# EasyEDA schematic SCH_Acid Charger - V1.json
TITLE: Sheet_1; REV: 1.0; Date: 2022-08-11; Sheet: 1/1; Drawn By: Giuseppe Mento; Company: Your Company
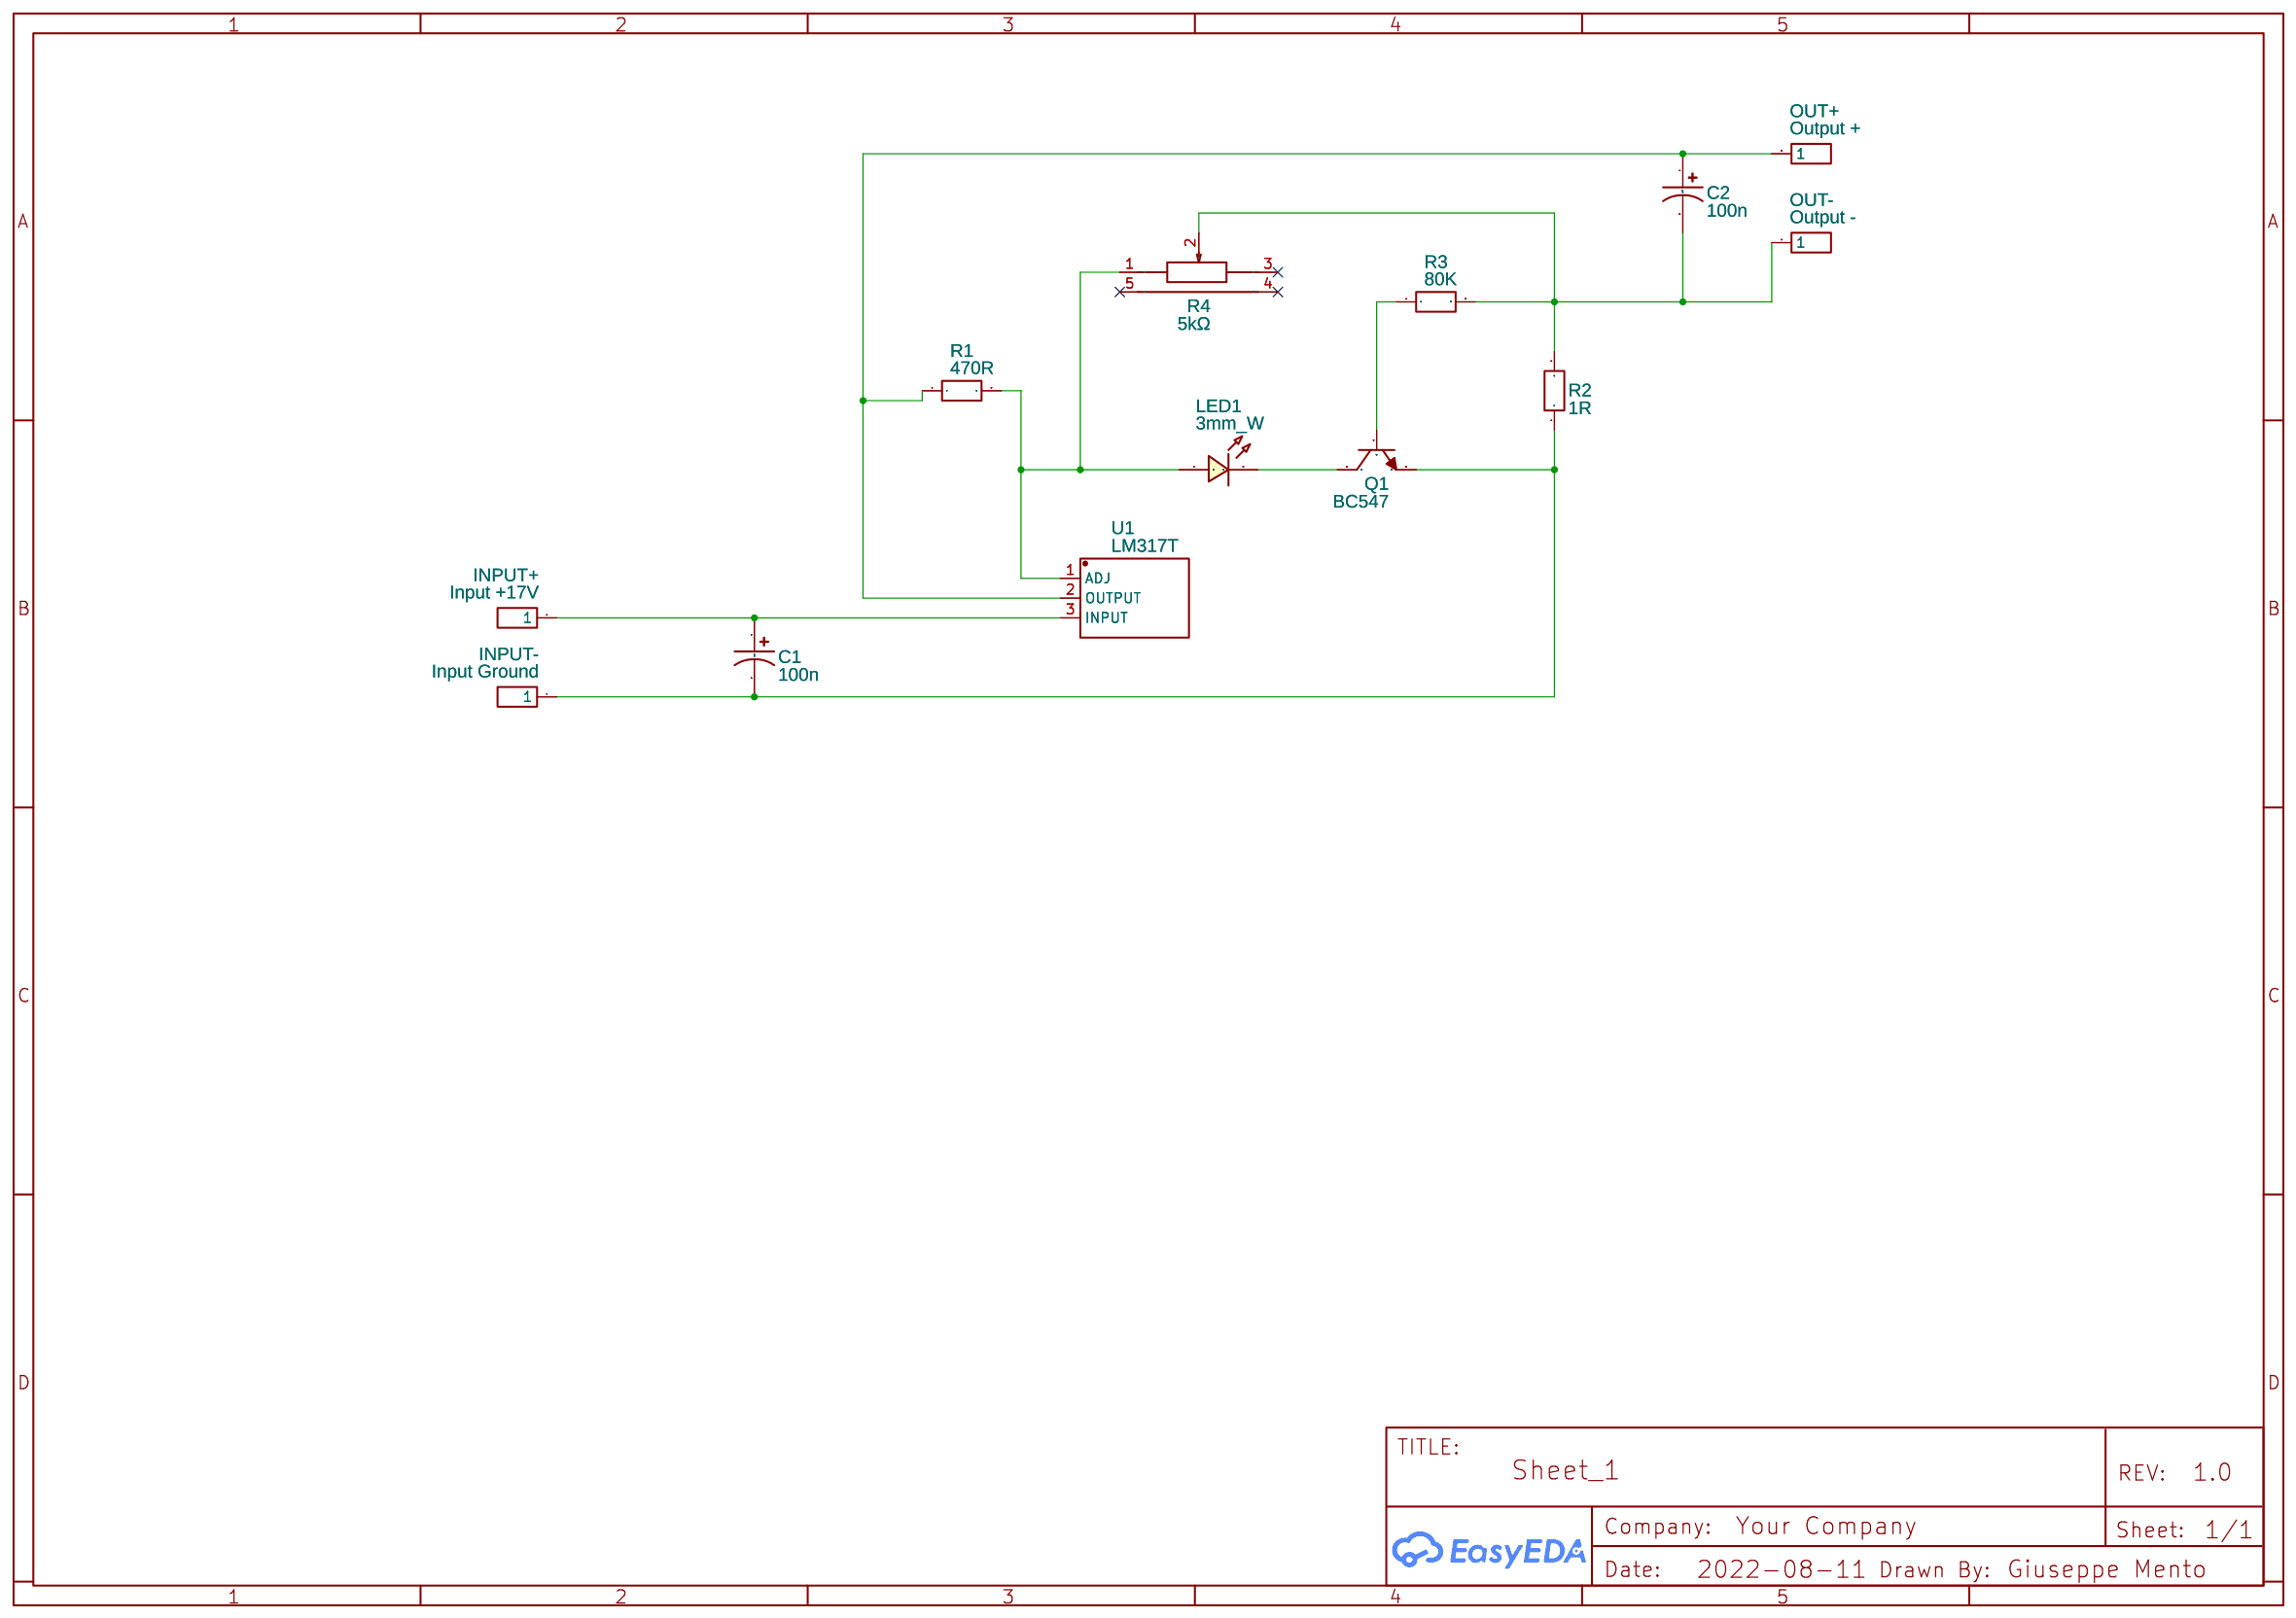
[diagram p0: schematic sheet]

## Parts
C1  100n  [CAP-D3.0×F1.5]
C2  100n  [CAP-D3.0×F1.5]
INPUT+  Input +17V  [HDR-M-2.54_1X1]
INPUT-  Input Ground  [HDR-M-2.54_1X1]
LED1  3mm_W  [LED-TH_BD3.0_BLUE]
OUT+  Output +  [HDR-M-2.54_1X1]
OUT-  Output -  [HDR-M-2.54_1X1]
Q1  BC547  [TO-92-3_L4.8-W3.7-P1.27-L]
R1  470R  [R_AXIAL-0.4]
R2  1R  [R_AXIAL-0.6]
R3  80K  [R_AXIAL-0.4]
R4  5kΩ  [RES-TH_RK09K1130A70]
U1  LM317T  [TO-220AB-3_L10.4-W4.6-P2.54-T]

## Library data of the parts
C1 C2 = CE_TH_D3.0×F1.5_US: Contributor: LCEDA_Lib
INPUT+ INPUT- OUT+ OUT- = HDR-M-2.54_1x1: Supplier Part: C81276; Supplier: LCSC; Contributor: LCEDA_Lib
LED1 = LED-TH-3mm_B: Manufacturer: EVERLIGHT(台湾亿光); Manufacturer Part: 204-10SUBC/S400-A4; Supplier Part: C86881; Supplier: LCSC; Contributor: LCEDA_Lib
Q1 = BC547: Supplier: LCSC; Supplier Part: C2910381; Manufacturer: CJ（江苏长电/长晶）; link: https://atta.szlcsc.com/upload/public/pdf/source/20220322/35437BB3E522E0C3E451097265A180DC.pdf; Contributor: LCSC
R1 R3 = R_AXIAL-0.6_EU: Contributor: LCEDA_Lib
R2 = R_AXIAL-0.6_EU: Contributor: LCEDA_Lib; Package Display: No
R4 = RK09K1130BM4: Supplier: LCSC; Supplier Part: C470293; Manufacturer: ALPSALPINE(阿尔卑斯阿尔派); Contributor: lcsc
U1 = LM317T: Supplier: LCSC; Supplier Part: C361026; Manufacturer: STMicroelectronics; Contributor: LCSC; JLCPCB Part Class: Extended Part

## Nets
Net-(C1-1): C1.1 INPUT+.1 U1.3(INPUT)
Net-(C1-2): C1.2 INPUT-.1 Q1.3(E) R2.1
Net-(C2-1): C2.1 OUT+.1 R1.1 U1.2(OUTPUT)
Net-(C2-2): C2.2 OUT-.1 R2.2 R3.2 R4.2
Net-(LED1-1): LED1.1 R1.2 R4.1 U1.1(ADJ)
Net-(LED1-2): LED1.2 Q1.1(C)
Net-(Q1-2): Q1.2(B) R3.1

Not connected (* = marked no-connect by the designer): R4 3* 4(EH)* 5(EH)*
